# EAGLE schematic mcp23017_grundschaltung (EAGLE 8.2.1)
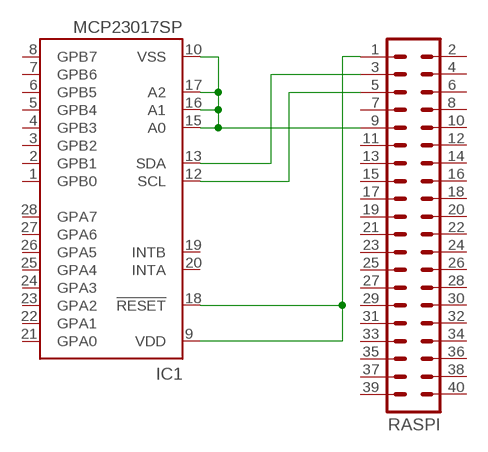
[diagram p0: schematic, sheet 1]

## Parts
IC1  MCP23017SP  [DIL28-3]
RASPI  ML40  [ML40]

## Nets
N$1: IC1.9(VDD) IC1.18(!RESET) RASPI.1
N$2: IC1.10(VSS) IC1.15(A0) IC1.16(A1) IC1.17(A2) RASPI.9
N$3: IC1.13(SDA) RASPI.3
N$4: IC1.12(SCL) RASPI.5
Unconnected: IC1.1(GPB0) IC1.2(GPB1) IC1.3(GPB2) IC1.4(GPB3) IC1.5(GPB4) IC1.6(GPB5) IC1.7(GPB6) IC1.8(GPB7) IC1.19(INTB) IC1.20(INTA) IC1.21(GPA0) IC1.22(GPA1) IC1.23(GPA2) IC1.24(GPA3) IC1.25(GPA4) IC1.26(GPA5) IC1.27(GPA6) IC1.28(GPA7) RASPI.2 RASPI.4 RASPI.6 RASPI.7 RASPI.8 RASPI.10 RASPI.11 RASPI.12 RASPI.13 RASPI.14 RASPI.15 RASPI.16 RASPI.17 RASPI.18 RASPI.19 RASPI.20 RASPI.21 RASPI.22 RASPI.23 RASPI.24 RASPI.25 RASPI.26 RASPI.27 RASPI.28 RASPI.29 RASPI.30 RASPI.31 RASPI.32 RASPI.33 RASPI.34 RASPI.35 RASPI.36 RASPI.37 RASPI.38 RASPI.39 RASPI.40

## Library data of the parts
IC1 = microchip:MCP23017: http://ww1.microchip.com/downloads/en/DeviceDoc/21952a.pdf Source: http://ww1.microchip.com/downloads/en/DeviceDoc/21952a.pdf; MF: MICROCHIP; MPN: MCP23017-E/SP; OC_FARNELL: 1332088; OC_NEWARK: 31K2959
RASPI = con-ml:ML40: HARTING; OC_FARNELL: unknown; OC_NEWARK: unknown